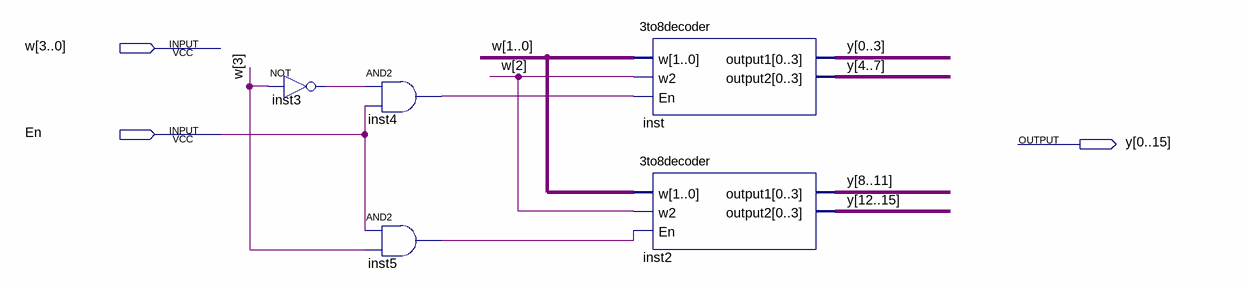
[diagram p0: schematic sheet]
// Quartus schematic 4to16decoder.bdf as structural Verilog: 5 symbols, 3 pins
module \4to16decoder  (
  input  [3:0] w,
  input  En,
  output [0:15] y
);

  wire inst3_out, inst4_out, inst5_out;

  not inst3 (inst3_out, w[3]);
  and inst4 (inst4_out, inst3_out, En);
  and inst5 (inst5_out, En, w[3]);
  \3to8decoder  inst (.w(w[1:0]), .w2(w[2]), .En(inst4_out), .output1(y[0:3]), .output2(y[4:7]));
  \3to8decoder  inst2 (.w(w[1:0]), .w2(w[2]), .En(inst5_out), .output1(y[8:11]), .output2(y[12:15]));
endmodule
